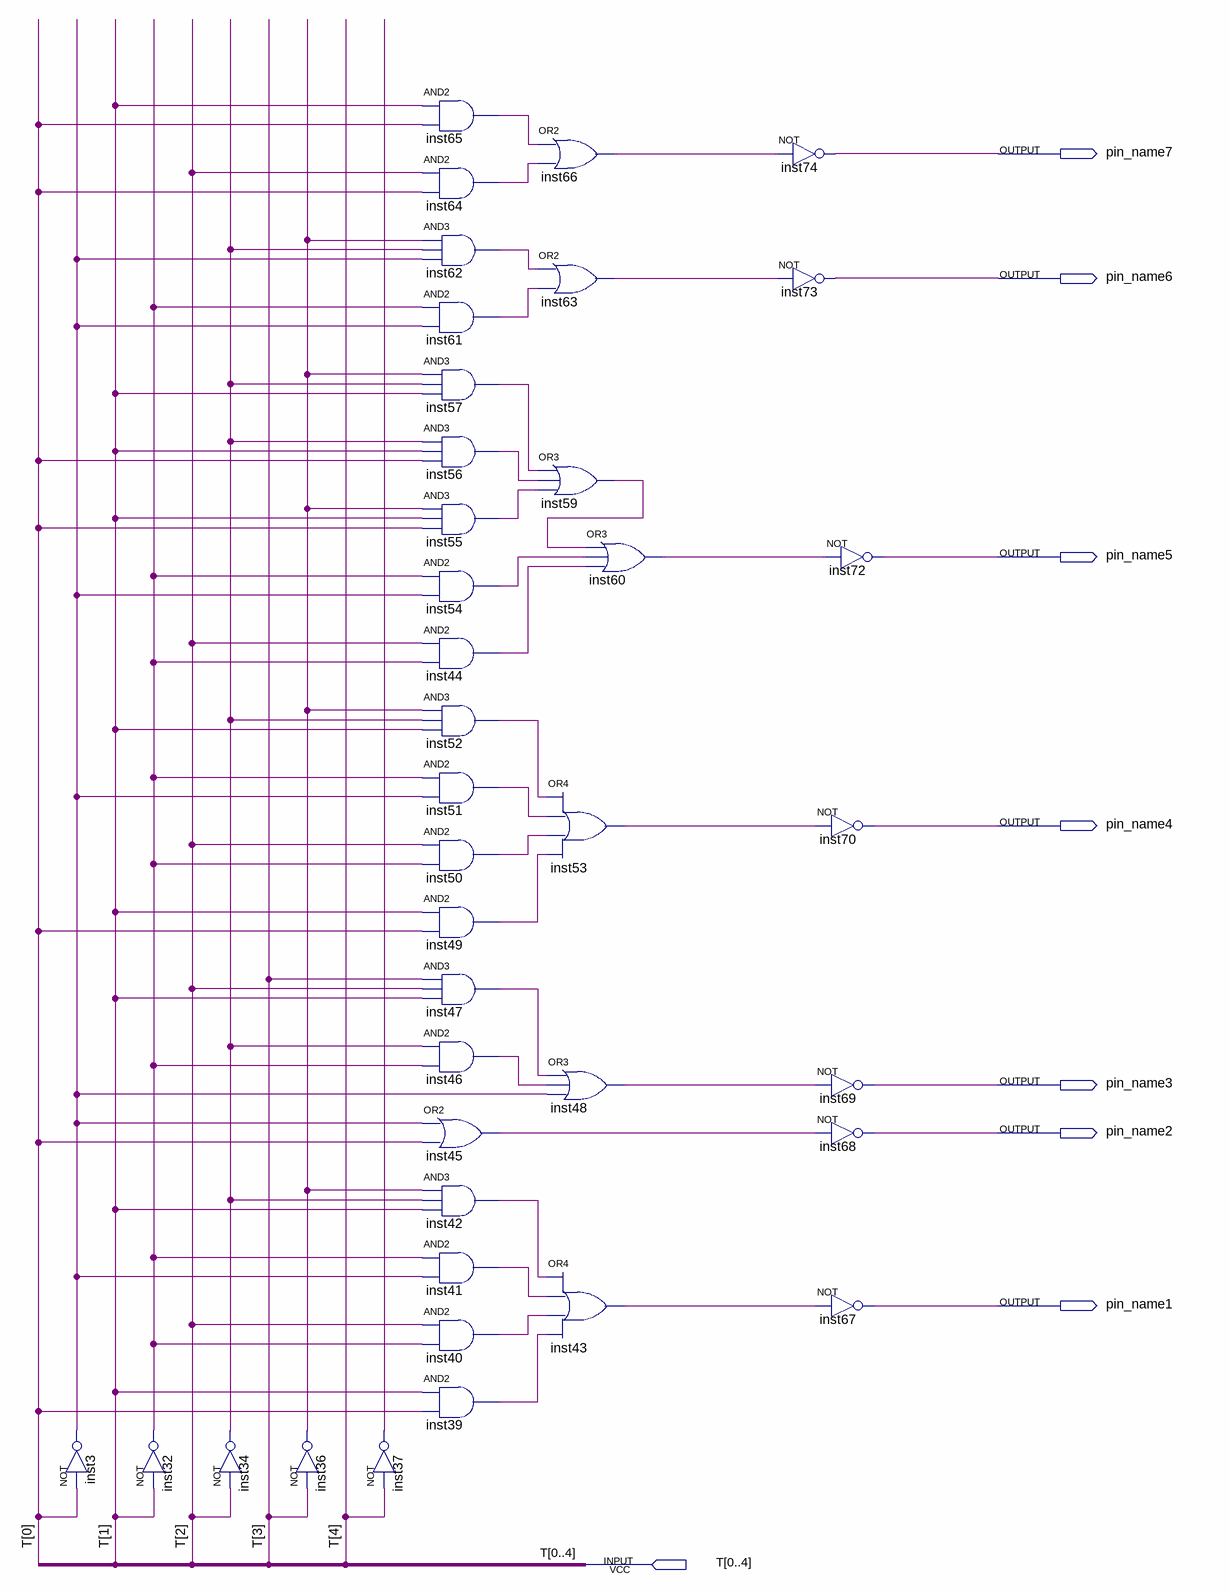
[diagram p0: schematic sheet]
// Quartus schematic 7Segmentos-2.bdf as structural Verilog: 39 symbols, 8 pins
module \7Segmentos-2  (
  input  [0:4] T,
  output pin_name7,
  output pin_name6,
  output pin_name5,
  output pin_name4,
  output pin_name3,
  output pin_name2,
  output pin_name1
);

  wire inst3_out, inst32_out, inst34_out, inst36_out, inst37_out, inst39_out, inst40_out, inst41_out,
       inst42_out, inst43_out, inst44_out, inst45_out, inst46_out, inst47_out, inst48_out, inst49_out,
       inst50_out, inst51_out, inst52_out, inst53_out, inst54_out, inst55_out, inst56_out, inst57_out,
       inst59_out, inst60_out, inst61_out, inst62_out, inst63_out, inst64_out, inst65_out, inst66_out;

  not inst3 (inst3_out, T[0]);
  not inst32 (inst32_out, T[1]);
  not inst34 (inst34_out, T[2]);
  not inst36 (inst36_out, T[3]);
  not inst37 (inst37_out, T[4]);
  and inst65 (inst65_out, T[1], T[0]);
  and inst64 (inst64_out, T[2], T[0]);
  and inst62 (inst62_out, inst36_out, inst34_out, inst3_out);
  and inst61 (inst61_out, inst32_out, inst3_out);
  and inst57 (inst57_out, inst36_out, inst34_out, T[1]);
  and inst56 (inst56_out, inst34_out, T[1], T[0]);
  and inst55 (inst55_out, inst36_out, T[1], T[0]);
  and inst54 (inst54_out, inst32_out, inst3_out);
  and inst44 (inst44_out, T[2], inst32_out);
  and inst52 (inst52_out, inst36_out, inst34_out, T[1]);
  and inst51 (inst51_out, inst32_out, inst3_out);
  and inst50 (inst50_out, T[2], inst32_out);
  and inst49 (inst49_out, T[1], T[0]);
  and inst47 (inst47_out, T[3], T[2], T[1]);
  and inst46 (inst46_out, inst34_out, inst32_out);
  or inst45 (inst45_out, inst3_out, T[0]);
  and inst42 (inst42_out, inst36_out, inst34_out, T[1]);
  and inst41 (inst41_out, inst32_out, inst3_out);
  and inst40 (inst40_out, T[2], inst32_out);
  and inst39 (inst39_out, T[1], T[0]);
  or inst66 (inst66_out, inst65_out, inst64_out);
  or inst63 (inst63_out, inst62_out, inst61_out);
  or inst59 (inst59_out, inst57_out, inst56_out, inst55_out);
  or inst53 (inst53_out, inst52_out, inst51_out, inst50_out, inst49_out);
  or inst48 (inst48_out, inst47_out, inst46_out, inst3_out);
  or inst43 (inst43_out, inst42_out, inst41_out, inst40_out, inst39_out);
  or inst60 (inst60_out, inst59_out, inst54_out, inst44_out);
  not inst74 (pin_name7, inst66_out);
  not inst73 (pin_name6, inst63_out);
  not inst72 (pin_name5, inst60_out);
  not inst70 (pin_name4, inst53_out);
  not inst69 (pin_name3, inst48_out);
  not inst68 (pin_name2, inst45_out);
  not inst67 (pin_name1, inst43_out);
endmodule
